# EAGLE design fretscanner-untangle2 (EAGLE 6.6.0)
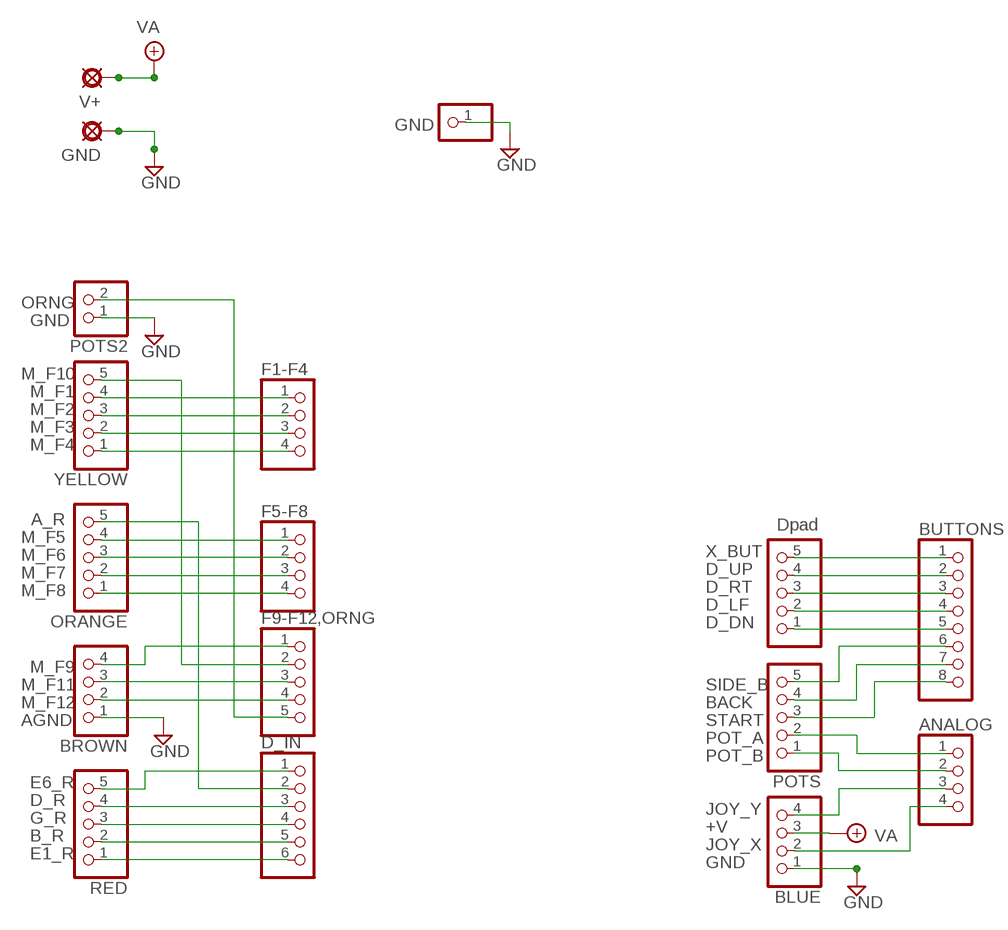
[diagram p0: schematic, sheet 1]

## Parts
ANALOG  PINHD-1X4  [1X04]
BLUE  PINHD-1X4  [1X04]
BROWN  PINHD-1X4  [1X04]
BUTTONS  PINHD-1X8  [1X08]
D_IN  PINHD-1X6  [1X06]
DPAD  PINHD-1X5  [1X05]
DPAD2  PINHD-1X1  [1X01]
F1-F4  PINHD-1X4  [1X04]
F5-F8  PINHD-1X4  [1X04]
F9-F12,ORNG  PINHD-1X5  [1X05]
GND  PADL  [LONG]
ORANGE  PINHD-1X5  [1X05]
POTS  PINHD-1X5  [1X05]
POTS2  PINHD-1X2  [1X02]
RED  PINHD-1X5  [1X05]
V+  PADL  [LONG]
YELLOW  PINHD-1X5  [1X05]

## Nets
BACK: BUTTONS.7 POTS.4
D0: D_IN.1 RED.5
GND: BLUE.1 BROWN.1 DPAD2.1 GND.1(PAD) POTS2.1
JOY_X: ANALOG.4 BLUE.2
JOY_Y: ANALOG.3 BLUE.4
N$1: F1-F4.1 YELLOW.4
N$2: F1-F4.2 YELLOW.3
N$3: F1-F4.3 YELLOW.2
N$4: F1-F4.4 YELLOW.1
N$5: F5-F8.1 ORANGE.4
N$6: F5-F8.2 ORANGE.3
N$7: F5-F8.3 ORANGE.2
N$8: F5-F8.4 ORANGE.1
N$9: BROWN.4 F9-F12,ORNG.1
N$10: F9-F12,ORNG.2 YELLOW.5
N$11: D_IN.3 RED.4
N$12: D_IN.4 RED.3
N$13: D_IN.2 ORANGE.5
N$14: BROWN.3 F9-F12,ORNG.3
N$15: BROWN.2 F9-F12,ORNG.4
N$16: F9-F12,ORNG.5 POTS2.2
N$17: D_IN.5 RED.2
N$18: D_IN.6 RED.1
N$19: BUTTONS.1 DPAD.5
N$20: BUTTONS.2 DPAD.4
N$21: BUTTONS.3 DPAD.3
N$22: BUTTONS.4 DPAD.2
N$23: BUTTONS.5 DPAD.1
POT_A: ANALOG.1 POTS.2
POT_B: ANALOG.2 POTS.1
SIDE_B: BUTTONS.6 POTS.5
START: BUTTONS.8 POTS.3
VA: BLUE.3 V+.1(PAD)

## Notes on the sheet
- GND
- ORNG
- GND
- M_F10
- M_F1
- M_F2
- M_F3
- M_F4
- A_R
- M_F5 | Dpad
- M_F6
- X_BUT
- M_F7
- D_UP
- M_F8
- D_RT
- D_LF
- D_DN
- M_F9
- M_F11 | SIDE_B
- M_F12 | BACK
- AGND | START
- POT_A
- POT_B
- E6_R
- D_R
- JOY_Y
- G_R
- +V
- B_R
- JOY_X
- E1_R
- GND

## Library data of the parts
ANALOG BLUE BROWN F1-F4 F5-F8 = pinhead:PINHD-1X4: PIN HEADER
BUTTONS = pinhead:PINHD-1X8: PIN HEADER
D_IN = pinhead:PINHD-1X6: PIN HEADER
DPAD F9-F12,ORNG ORANGE POTS RED YELLOW = pinhead:PINHD-1X5: PIN HEADER
DPAD2 = pinhead:PINHD-1X1: PIN HEADER
GND V+ = gm-supply:PAD: PAD use this package for pads with any purpose, including input, output, send or return various pad shapes: round, square, octogonal, long, and long offset
POTS2 = pinhead:PINHD-1X2: PIN HEADER

## Board
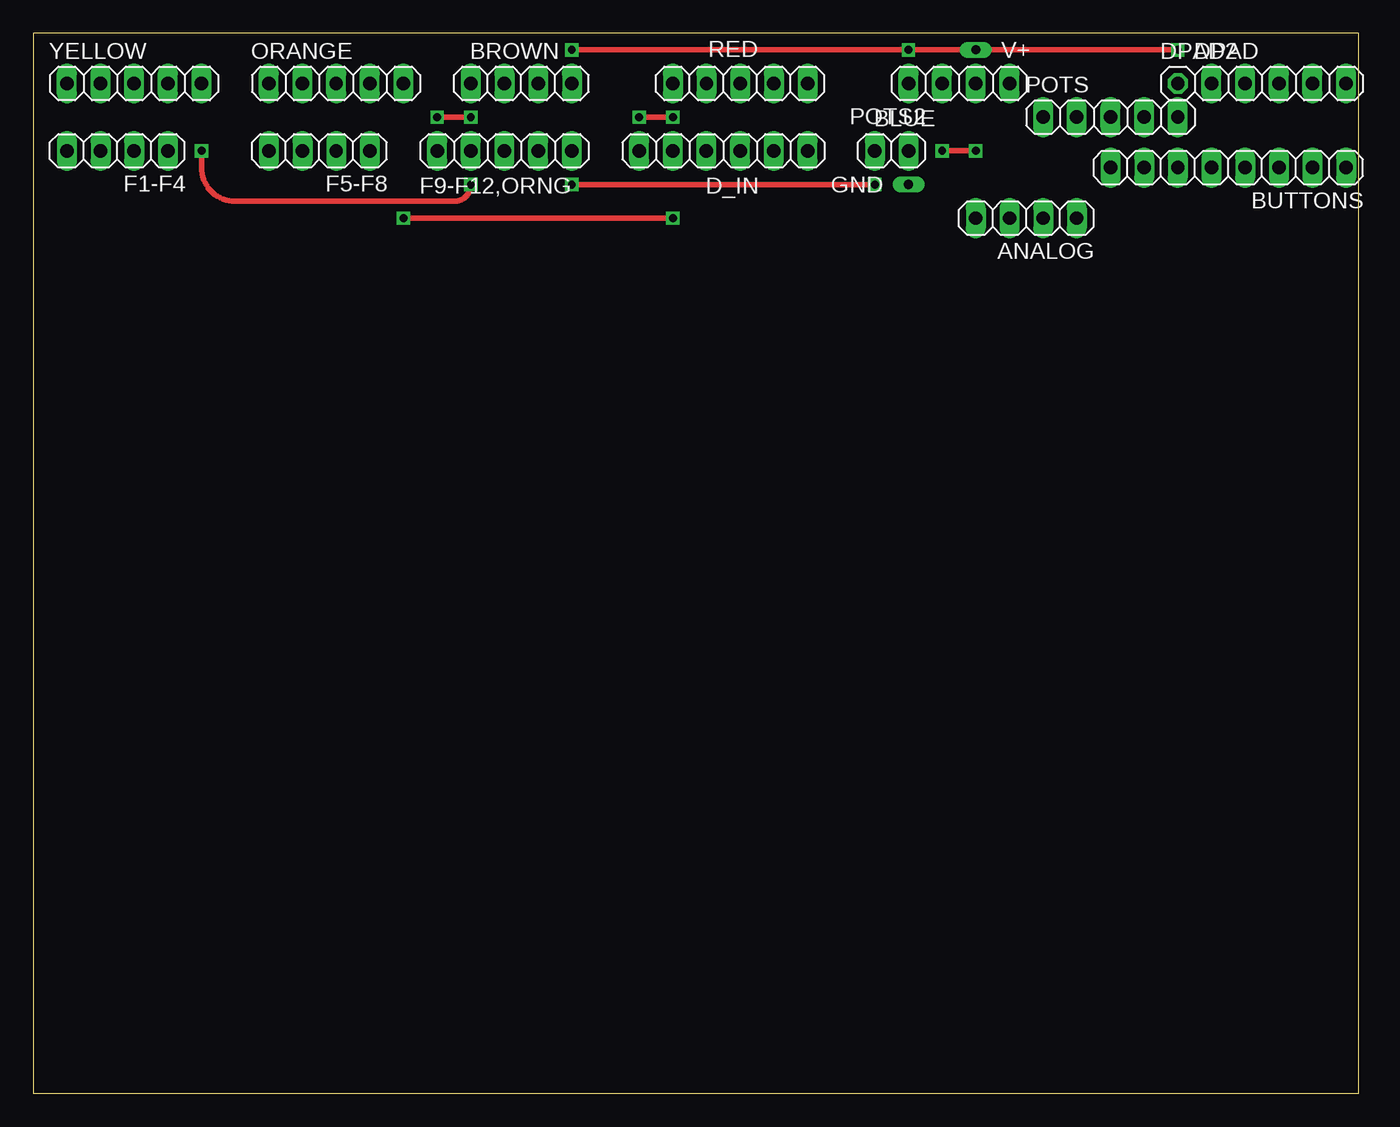
[diagram p1: board, top side]
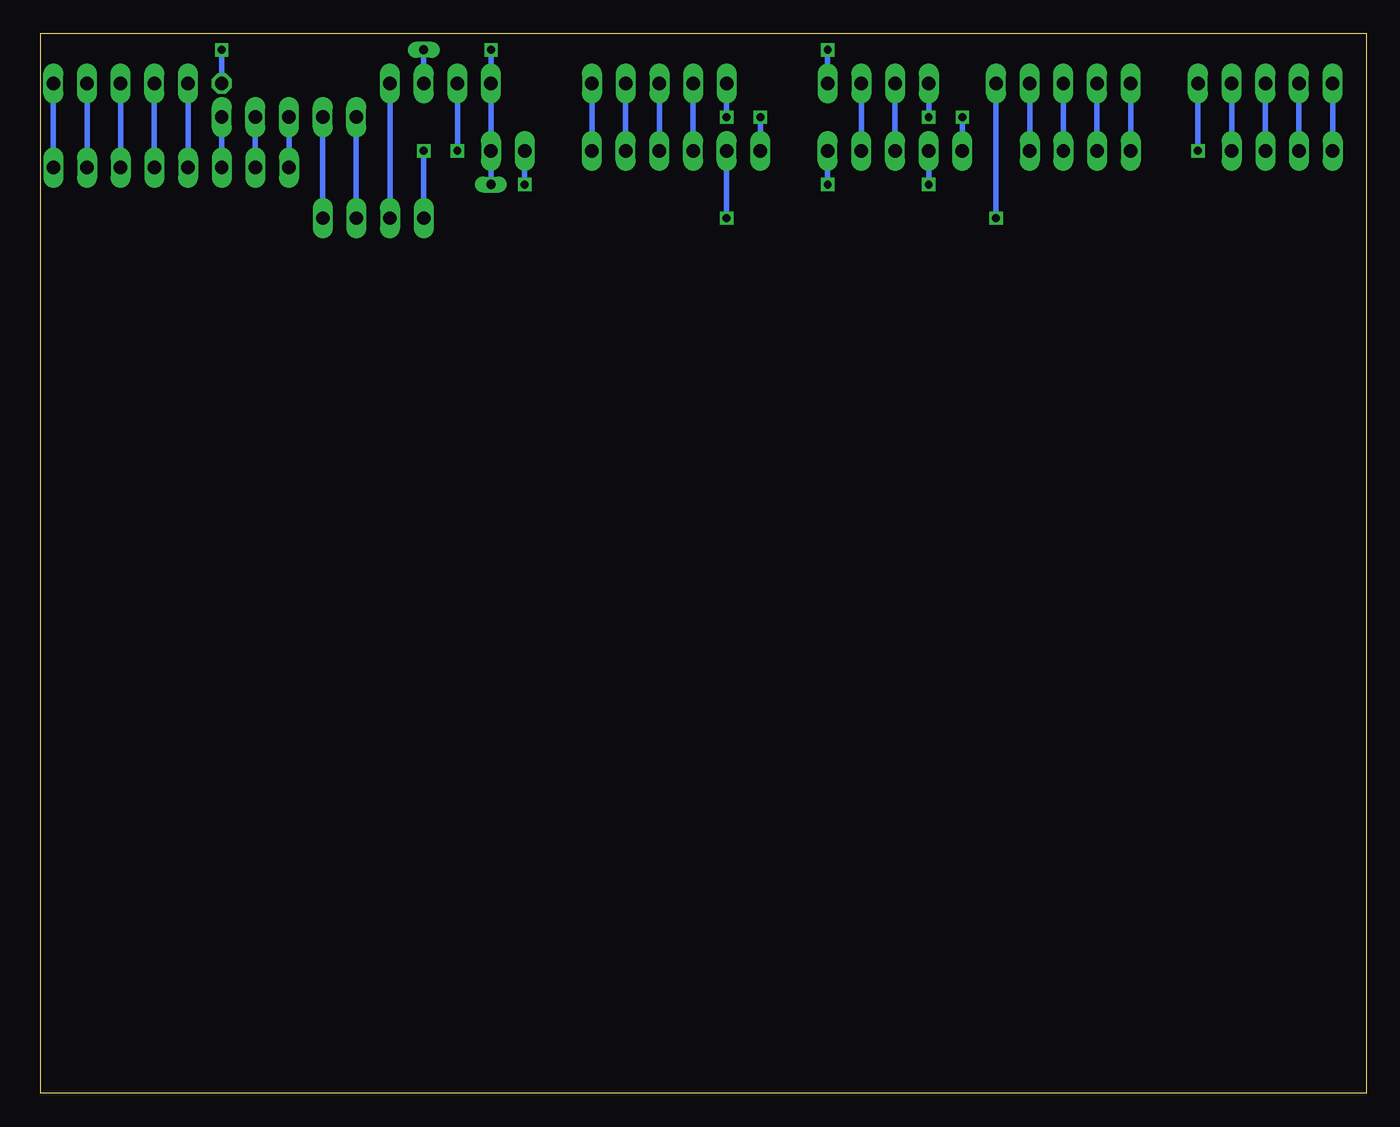
[diagram p2: board, bottom side, seen from below]

Size 100 x 80 mm. Coordinates in mm from the lower left corner, seen from the top.
Outline: 0,0 100,0 100,80 0,80 0,0
Copper layers (1*16): Top 0.035mm / dielectric 1.5mm / Bottom 0.035mm
Design rules "default": minimum track width 10mil, minimum drill 24mil, track to track 8mil, track to pad 8mil, pad to pad 8mil, via to via 8mil, smd to smd 8mil, copper to edge 40mil, drill to drill 8mil, minimum pad ring 10mil, minimum via ring 8mil, stop-mask expansion 4mil, vias tented up to drill 0mil, thermal gap 10mil

### Footprints (pad centres in the part's own frame; a part is rotated, then mirrored left to right if it is on the bottom)
1X04 = drill 1.016 long: 1 -3.81,0; 2 -1.27,0; 3 1.27,0; 4 3.81,0
1X08 = drill 1.016 long: 1 -8.89,0; 2 -6.35,0; 3 -3.81,0; 4 -1.27,0; 5 1.27,0; 6 3.81,0; 7 6.35,0; 8 8.89,0
1X06 = drill 1.016 long: 1 -6.35,0; 2 -3.81,0; 3 -1.27,0; 4 1.27,0; 5 3.81,0; 6 6.35,0
1X05 = drill 1.016 long: 1 -5.08,0; 2 -2.54,0; 3 0,0; 4 2.54,0; 5 5.08,0
1X01 = drill 1.016 octagon: 1 0,0
LONG = drill 0.7 long: 1 0,0
1X02 = drill 1.016 long: 1 -1.27,0; 2 1.27,0

### Placement (x,y rotation side)
ANALOG  74.93,66.04 180 top
BLUE  69.85,76.2 0 top
BROWN  36.83,76.2 180 top
BUTTONS  90.17,69.85 180 top
D_IN  52.07,71.12 0 top
DPAD  93.98,76.2 0 top
DPAD2  86.36,76.2 0 top
F1-F4  6.35,71.12 180 top
F5-F8  21.59,71.12 180 top
F9-F12,ORNG  35.56,71.12 0 top
GND  66.04,68.58 180 top
ORANGE  22.86,76.2 0 top
POTS  81.28,73.66 0 top
POTS2  64.77,71.12 180 top
RED  53.34,76.2 180 top
V+  71.12,78.74 0 top
YELLOW  7.62,76.2 0 top

### Tracks (layer width: path | path; a pad name or v marks a point on that pad's centre or on a via)
BACK
  Bottom 0.406: POTS.4 BUTTONS.7
D0  (via drill 0.6)
  Top 0.406: v48.26,73.66 v45.72,73.66
  Bottom 0.406: RED.5 v48.26,73.66 | v45.72,73.66 D_IN.1
GND  (via drill 0.6)
  Top 0.406: v40.64,78.74 v66.04,78.74 v86.36,78.74
  Bottom 0.406: BROWN.1 v40.64,78.74 | v66.04,78.74 BLUE.1 POTS2.1 GND.1 | v86.36,78.74 DPAD2.1
JOY_X  (via drill 0.6)
  Top 0.406: v68.58,71.12 v71.12,71.12
  Bottom 0.406: BLUE.2 v68.58,71.12 | v71.12,71.12 ANALOG.4
JOY_Y
  Bottom 0.406: BLUE.4 ANALOG.3
N$1
  Bottom 0.406: YELLOW.4 F1-F4.1
N$2
  Bottom 0.406: YELLOW.3 F1-F4.2
N$3
  Bottom 0.406: F1-F4.3 YELLOW.2
N$4
  Bottom 0.406: YELLOW.1 F1-F4.4
N$5
  Bottom 0.406: ORANGE.4 F5-F8.1
N$6
  Bottom 0.406: F5-F8.2 ORANGE.3
N$7
  Bottom 0.406: ORANGE.2 F5-F8.3
N$8
  Bottom 0.406: ORANGE.1 F5-F8.4
N$9  (via drill 0.6)
  Top 0.406: v33.02,73.66 v30.48,73.66
  Bottom 0.406: BROWN.4 v33.02,73.66 | v30.48,73.66 F9-F12,ORNG.1
N$10  (via drill 0.6)
  Top 0.406: v33.02,68.58 arc-90 31.75,67.31 15.24,67.31 arc-90 12.7,69.85 v12.7,71.12
  Bottom 0.406: F9-F12,ORNG.2 v33.02,68.58 | v12.7,71.12 YELLOW.5
N$11
  Bottom 0.406: D_IN.3 RED.4
N$12
  Bottom 0.406: D_IN.4 RED.3
N$13  (via drill 0.6)
  Top 0.406: v27.94,66.04 v48.26,66.04
  Bottom 0.406: ORANGE.5 v27.94,66.04 | v48.26,66.04 D_IN.2
N$14
  Bottom 0.406: BROWN.3 F9-F12,ORNG.3
N$15
  Bottom 0.406: BROWN.2 F9-F12,ORNG.4
N$16  (via drill 0.6)
  Top 0.406: v40.64,68.58 v63.5,68.58
  Bottom 0.406: F9-F12,ORNG.5 v40.64,68.58 | v63.5,68.58 POTS2.2
N$17
  Bottom 0.406: D_IN.5 RED.2
N$18
  Bottom 0.406: D_IN.6 RED.1
N$19
  Bottom 0.406: BUTTONS.1 DPAD.5
N$20
  Bottom 0.406: BUTTONS.2 DPAD.4
N$21
  Bottom 0.406: BUTTONS.3 DPAD.3
N$22
  Bottom 0.406: DPAD.2 BUTTONS.4
N$23
  Bottom 0.406: DPAD.1 BUTTONS.5
POT_A
  Bottom 0.406: POTS.2 ANALOG.1
POT_B
  Bottom 0.406: ANALOG.2 POTS.1
SIDE_B
  Bottom 0.406: BUTTONS.6 POTS.5
START
  Bottom 0.406: BUTTONS.8 POTS.3
VA
  Bottom 0.406: BLUE.3 V+.1